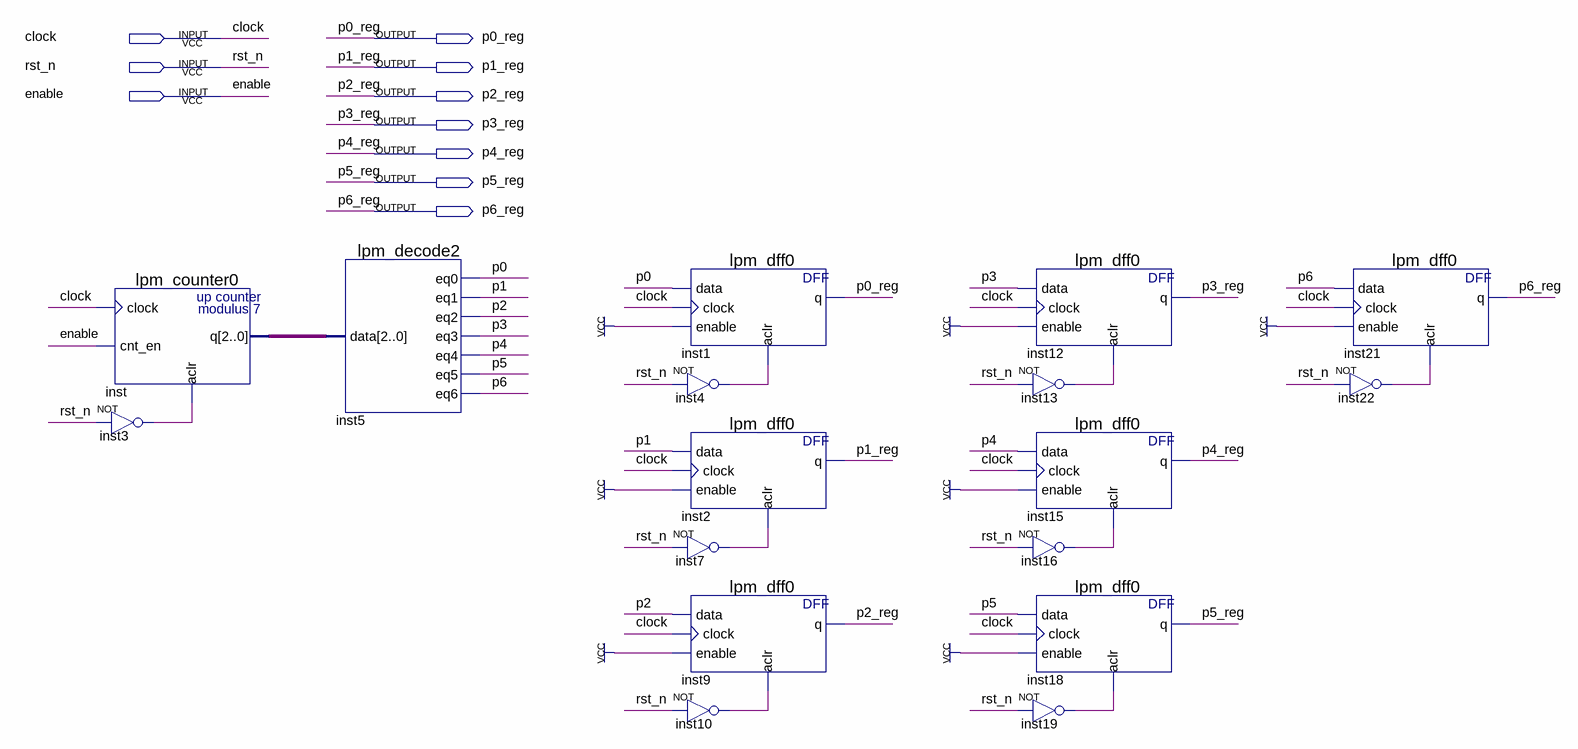
[diagram p0: schematic sheet]
// Quartus schematic phase_gen.bdf as structural Verilog: 17 symbols, 10 pins
module phase_gen (
  input  clock,
  input  rst_n,
  input  enable,
  output p0_reg,
  output p1_reg,
  output p2_reg,
  output p3_reg,
  output p4_reg,
  output p5_reg,
  output p6_reg
);

  wire inst3_out, inst4_out, inst7_out, inst10_out, inst13_out, inst16_out, inst19_out, inst22_out, p0, p1,
       p2, p3, p4, p5, p6;
  wire [2:0] inst_q;

  lpm_counter0 inst (.clock(clock), .cnt_en(enable), .aclr(inst3_out), .q(inst_q));
  not inst3 (inst3_out, rst_n);
  lpm_decode2 inst5 (.data(inst_q), .eq0(p0), .eq1(p1), .eq2(p2), .eq3(p3), .eq4(p4), .eq5(p5), .eq6(p6));
  lpm_dff0 inst1 (.data(p0), .clock(clock), .enable(1'b1), .aclr(inst4_out), .q(p0_reg));
  not inst4 (inst4_out, rst_n);
  lpm_dff0 inst2 (.data(p1), .clock(clock), .enable(1'b1), .aclr(inst7_out), .q(p1_reg));
  not inst7 (inst7_out, rst_n);
  lpm_dff0 inst9 (.data(p2), .clock(clock), .enable(1'b1), .aclr(inst10_out), .q(p2_reg));
  not inst10 (inst10_out, rst_n);
  lpm_dff0 inst12 (.data(p3), .clock(clock), .enable(1'b1), .aclr(inst13_out), .q(p3_reg));
  not inst13 (inst13_out, rst_n);
  lpm_dff0 inst15 (.data(p4), .clock(clock), .enable(1'b1), .aclr(inst16_out), .q(p4_reg));
  not inst16 (inst16_out, rst_n);
  lpm_dff0 inst18 (.data(p5), .clock(clock), .enable(1'b1), .aclr(inst19_out), .q(p5_reg));
  not inst19 (inst19_out, rst_n);
  lpm_dff0 inst21 (.data(p6), .clock(clock), .enable(1'b1), .aclr(inst22_out), .q(p6_reg));
  not inst22 (inst22_out, rst_n);
endmodule
